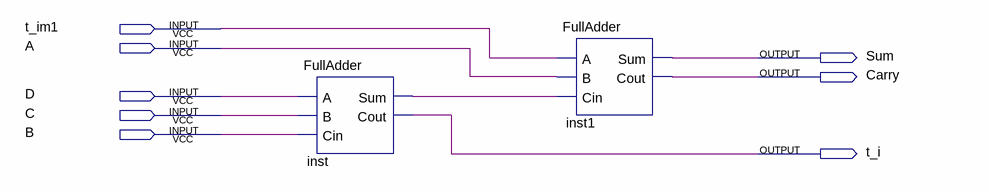
[diagram p0: schematic sheet]
// Quartus schematic 4to2_comp_v2.bdf as structural Verilog: 2 symbols, 8 pins
module \4to2_comp_v2  (
  input  t_im1,
  input  A,
  input  D,
  input  C,
  input  B,
  output Sum,
  output Carry,
  output t_i
);

  wire inst_sum;

  FullAdder inst (.A(D), .B(C), .Cin(B), .Sum(inst_sum), .Cout(t_i));
  FullAdder inst1 (.A(t_im1), .B(A), .Cin(inst_sum), .Sum(Sum), .Cout(Carry));
endmodule
